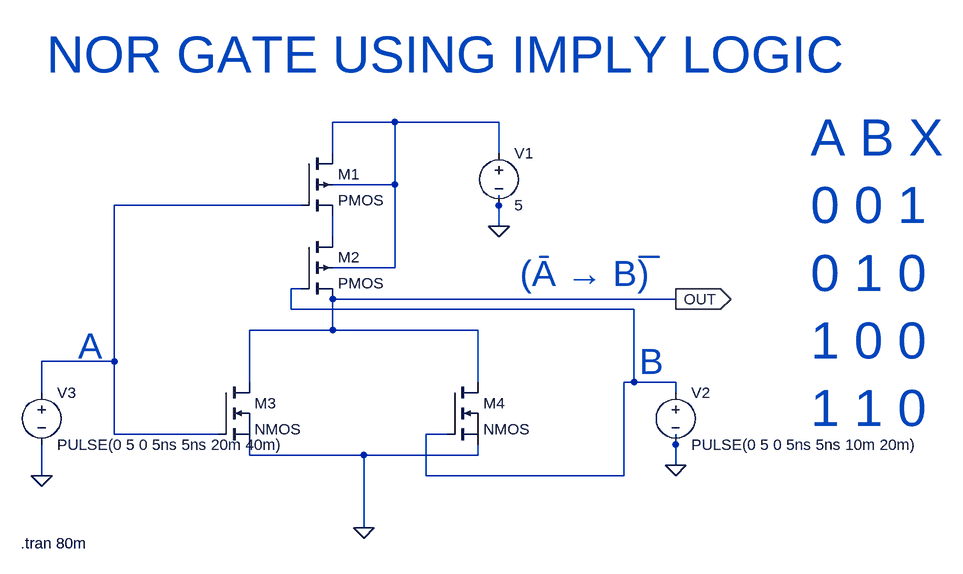
[diagram p0: schematic originalnorgateimply.asc]
originalnorgateimply.asc, the LTspice schematic file:
Version 4
SHEET 1 880 680
WIRE 32 -240 -64 -240
WIRE 192 -240 32 -240
WIRE -64 -192 -64 -240
WIRE 192 -192 192 -240
WIRE 32 -144 32 -240
WIRE 32 -144 -64 -144
WIRE -112 -112 -400 -112
WIRE 192 -112 192 -128
WIRE 192 -80 192 -112
WIRE -64 -64 -64 -96
WIRE 32 -16 32 -144
WIRE 32 -16 -64 -16
WIRE -112 16 -128 16
WIRE 464 32 -64 32
WIRE -128 48 -128 16
WIRE 400 48 -128 48
WIRE -64 80 -64 32
WIRE -64 80 -192 80
WIRE 160 80 -64 80
WIRE -400 128 -400 -112
WIRE -400 128 -512 128
WIRE -192 160 -192 80
WIRE 160 160 160 80
WIRE 400 160 400 48
WIRE 400 160 384 160
WIRE 464 160 400 160
WIRE -512 176 -512 128
WIRE 464 176 464 160
WIRE -400 240 -400 128
WIRE -240 240 -400 240
WIRE 112 240 80 240
WIRE 464 256 464 240
WIRE -192 272 -192 256
WIRE -16 272 -192 272
WIRE 160 272 160 256
WIRE 160 272 -16 272
WIRE 464 288 464 256
WIRE -512 304 -512 256
WIRE 80 304 80 240
WIRE 384 304 384 160
WIRE 384 304 80 304
WIRE -16 384 -16 272
FLAG -512 304 0
FLAG -16 384 0
FLAG 464 288 0
FLAG 192 -80 0
FLAG 464 32 OUT
IOPIN 464 32 Out
SYMBOL pmos4 -112 -192 R0
SYMATTR InstName M1
SYMBOL pmos4 -112 -64 R0
SYMATTR InstName M2
SYMBOL nmos -240 160 R0
SYMATTR InstName M3
SYMBOL nmos 112 160 R0
SYMATTR InstName M4
SYMBOL voltage 192 -208 R0
WINDOW 123 0 0 Left 0
WINDOW 39 0 0 Left 0
SYMATTR InstName V1
SYMATTR Value 5
SYMBOL voltage 464 160 R0
WINDOW 123 0 0 Left 0
WINDOW 39 0 0 Left 0
SYMATTR InstName V2
SYMATTR Value PULSE(0 5 0 5ns 5ns 10m 20m)
SYMBOL voltage -512 160 R0
WINDOW 123 0 0 Left 0
WINDOW 39 0 0 Left 0
SYMATTR InstName V3
SYMATTR Value PULSE(0 5 0 5ns 5ns 20m 40m)
TEXT -544 408 Left 2 !.tran 80m
TEXT -456 104 Left 5 ;A
TEXT 408 128 Left 5 ;B
TEXT 224 -8 Left 5 ;(Ā → B)̅
TEXT -504 -344 Left 6 ;NOR GATE USING IMPLY LOGIC
TEXT 672 -216 Left 6 ;A B X\n0 0 1\n0 1 0\n1 0 0\n1 1 0

The netlist it stands for:
* originalnorgateimply.asc
M1 N001 N002 N003 N001 PMOS
M2 N003 N004 OUT N001 PMOS
M3 OUT N002 0 0 NMOS
M4 OUT N004 0 0 NMOS
V1 N001 0 5
V2 N004 0 PULSE(0 5 0 5ns 5ns 10m 20m)
V3 N002 0 PULSE(0 5 0 5ns 5ns 20m 40m)
.model NMOS NMOS
.model PMOS PMOS
.lib standard.mos
.tran 80m
* A
* B
* (Ā → B)̅
* NOR GATE USING IMPLY LOGIC
* A B X
* 0 0 1
* 0 1 0
* 1 0 0
* 1 1 0
.backanno
.end